# Altium schematic sheet sensor.SchDoc
size A3; SheetNumber: 2; SheetTotal: 3
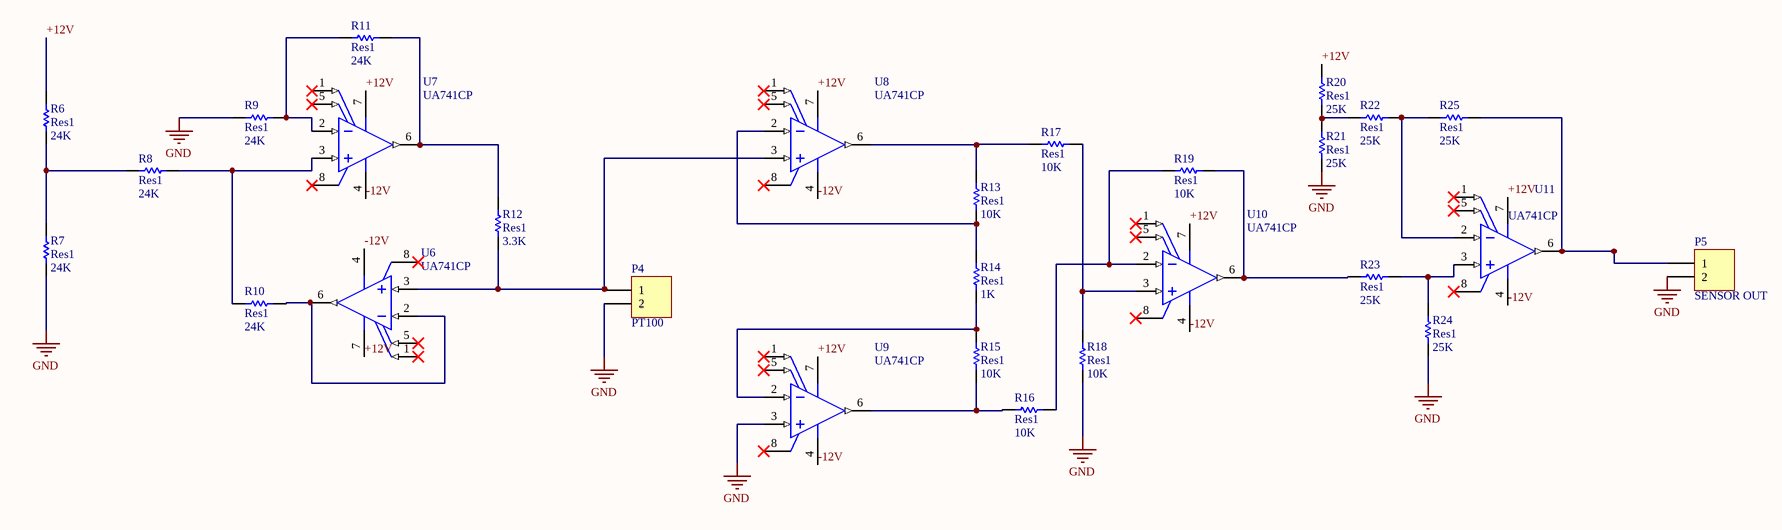
[diagram p0: sensor.SchDoc]

## Parts
P4  PT100  [HDR1X2]
P5  SENSOR OUT  [HDR1X2]
R6  Res1  value 24K  [AXIAL-0.3]
R7  Res1  value 24K  [AXIAL-0.3]
R8  Res1  value 24K  [AXIAL-0.3]
R9  Res1  value 24K  [AXIAL-0.3]
R10  Res1  value 24K  [AXIAL-0.3]
R11  Res1  value 24K  [AXIAL-0.3]
R12  Res1  value 3.3K  [AXIAL-0.3]
R13  Res1  value 10K  [AXIAL-0.3]
R14  Res1  value 1K  [AXIAL-0.3]
R15  Res1  value 10K  [AXIAL-0.3]
R16  Res1  value 10K  [AXIAL-0.3]
R17  Res1  value 10K  [AXIAL-0.3]
R18  Res1  value 10K  [AXIAL-0.3]
R19  Res1  value 10K  [AXIAL-0.3]
R20  Res1  value 25K  [AXIAL-0.3]
R21  Res1  value 25K  [AXIAL-0.3]
R22  Res1  value 25K  [AXIAL-0.3]
R23  Res1  value 25K  [AXIAL-0.3]
R24  Res1  value 25K  [AXIAL-0.3]
R25  Res1  value 25K  [AXIAL-0.3]
U6  UA741CP  [P0008A]
U7  UA741CP  [P0008A]
U8  UA741CP  [P0008A]
U9  UA741CP  [P0008A]
U10  UA741CP  [P0008A]
U11  UA741CP  [P0008A]

## Nets
GND: P4.2 P5.2 R7.1 R9.2 R18.2 R21.1 R24.2 U9.3(IN+)
+12V: R6.2 R20.2 U6.7(VCC+) U7.7(VCC+) U8.7(VCC+) U9.7(VCC+) U10.7(VCC+) U11.7(VCC+)
-12V: U6.4(VCC-) U7.4(VCC-) U8.4(VCC-) U9.4(VCC-) U10.4(VCC-) U11.4(VCC-)
NetP4_1: P4.1 R12.2 U6.3(IN+) U8.3(IN+)
NetP5_1: P5.1 R25.2 U11.6(OUT)
NetR6_1: R6.1 R7.2 R8.2
NetR8_1: R8.1 R10.2 U7.3(IN+)
NetR9_1: R9.1 R11.2 U7.2(IN-)
NetR10_1: R10.1 U6.2(IN-) U6.6(OUT)
NetR11_1: R11.1 R12.1 U7.6(OUT)
NetR13_1: R13.1 R17.1 U8.6(OUT)
NetR13_2: R13.2 R14.1 U8.2(IN-)
NetR14_2: R14.2 R15.1 U9.2(IN-)
NetR15_2: R15.2 R16.1 U9.6(OUT)
NetR16_2: R16.2 R19.1 U10.2(IN-)
NetR17_2: R17.2 R18.1 U10.3(IN+)
NetR19_2: R19.2 R23.1 U10.6(OUT)
NetR20_1: R20.1 R21.2 R22.1
NetR22_2: R22.2 R25.1 U11.2(IN-)
NetR23_2: R23.2 R24.1 U11.3(IN+)

Not connected (* = marked no-connect by the designer): U6 1(OFFSET_N1)* 5(OFFSET_N2)* 8(NC)*; U7 1(OFFSET_N1)* 5(OFFSET_N2)* 8(NC)*; U8 1(OFFSET_N1)* 5(OFFSET_N2)* 8(NC)*; U9 1(OFFSET_N1)* 5(OFFSET_N2)* 8(NC)*; U10 1(OFFSET_N1)* 5(OFFSET_N2)* 8(NC)*; U11 1(OFFSET_N1)* 5(OFFSET_N2)* 8(NC)*

## Library data of the parts
P4 P5 = Header 2: Header, 2-Pin; LatestRevisionDate: 17-Jul-2002; LatestRevisionNote: Re-released for DXP Platform.; Publisher: Altium Limited
R6-R25 = Res1: Resistor; Published: 8-Jun-2000; LatestRevisionDate: 17-Jul-2002; LatestRevisionNote: Re-released for DXP Platform.; PackageReference: AXIAL-0.3; Publisher: Altium Limited; PackageDescription: Axial Device, Thru-Hole; 2 Leads; 0.3 in Pin Spacing
U6-U11 = CMP-0017-00973-2: General-Purpose Operational Amplifier, 7 to 36 V, 0 to 70 degC, 8-pin DIP (P8), Pb-Free (RoHS); Manufacturer: Texas Instruments; Iq per channel(Max)(mA): 2.8; Number of Channels: 1; Total Supply Voltage(Min)(+5V is 5, +/-5V is 10): 7; IIB(Max)(pA): 800000; Slew Rate(Typ)(V/us): 0.5; Total Supply Voltage(Max)(+5V is 5, +/-5V is 10): 36; Vio (25C)(Max)(mV): 6; CMRR(Min)(dB): 70; Sub Family: General Purpose Amplifier, High Supply Voltage Amplifier (>=30V); PackageVersion: 4040082/E, 04/2010; PackageReference: P0008A; ComponentLink1URL: http://www.ti.com/; Mounting Technology: Through Hole; ComponentLink1Description: Manufacturer URL; GBW(Typ)(MHz): 1; ComponentLink2Description: Datasheet; ComponentLink2URL: http://www.ti.com/lit/ds/symlink/ua741.pdf; PartNumber: UA741CP; Code_JEDEC: MS-001; ComponentLink3Description: Package Specification; DatasheetVersion: SLOS094B; ComponentLink3URL: http://www.ti.com/litv/pdf/mpdi001b; PackageDescription: 8-Pin Plastic In-Line, Body 9.59 x 6.35 mm, Pitch 2.54 mm; Eco-Plan: Pb-Free (RoHS)